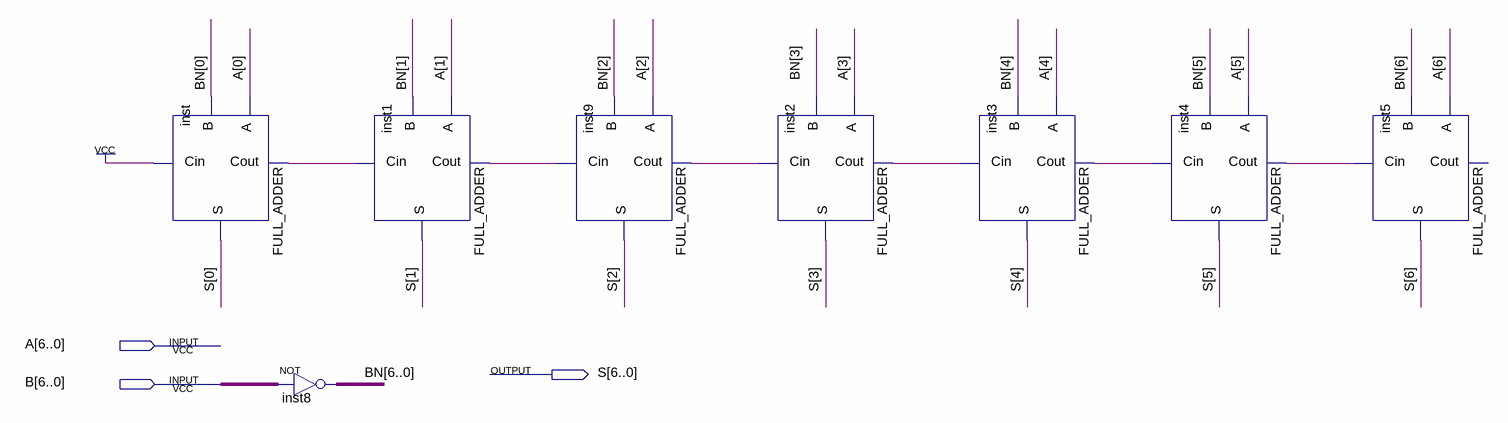
[diagram p0: schematic sheet]
// Quartus schematic SUB_7BIT.bdf as structural Verilog: 8 symbols, 3 pins
module SUB_7BIT (
  input  [6:0] A,
  input  [6:0] B,
  output [6:0] S
);

  wire inst1_cout, inst2_cout, inst3_cout, inst4_cout, inst9_cout, inst_cout;
  wire [6:0] BN;

  FULL_ADDER inst (.A(A[0]), .B(BN[0]), .Cin(1'b1), .S(S[0]), .Cout(inst_cout));
  assign BN = ~B;  // NOT inst8, 7 bits wide
  FULL_ADDER inst1 (.A(A[1]), .B(BN[1]), .Cin(inst_cout), .S(S[1]), .Cout(inst1_cout));
  FULL_ADDER inst9 (.A(A[2]), .B(BN[2]), .Cin(inst1_cout), .S(S[2]), .Cout(inst9_cout));
  FULL_ADDER inst2 (.A(A[3]), .B(BN[3]), .Cin(inst9_cout), .S(S[3]), .Cout(inst2_cout));
  FULL_ADDER inst3 (.A(A[4]), .B(BN[4]), .Cin(inst2_cout), .S(S[4]), .Cout(inst3_cout));
  FULL_ADDER inst4 (.A(A[5]), .B(BN[5]), .Cin(inst3_cout), .S(S[5]), .Cout(inst4_cout));
  FULL_ADDER inst5 (.A(A[6]), .B(BN[6]), .Cin(inst4_cout), .S(S[6]));  // open: Cout
endmodule
